# EAGLE design skillshare (EAGLE 9.6.2)
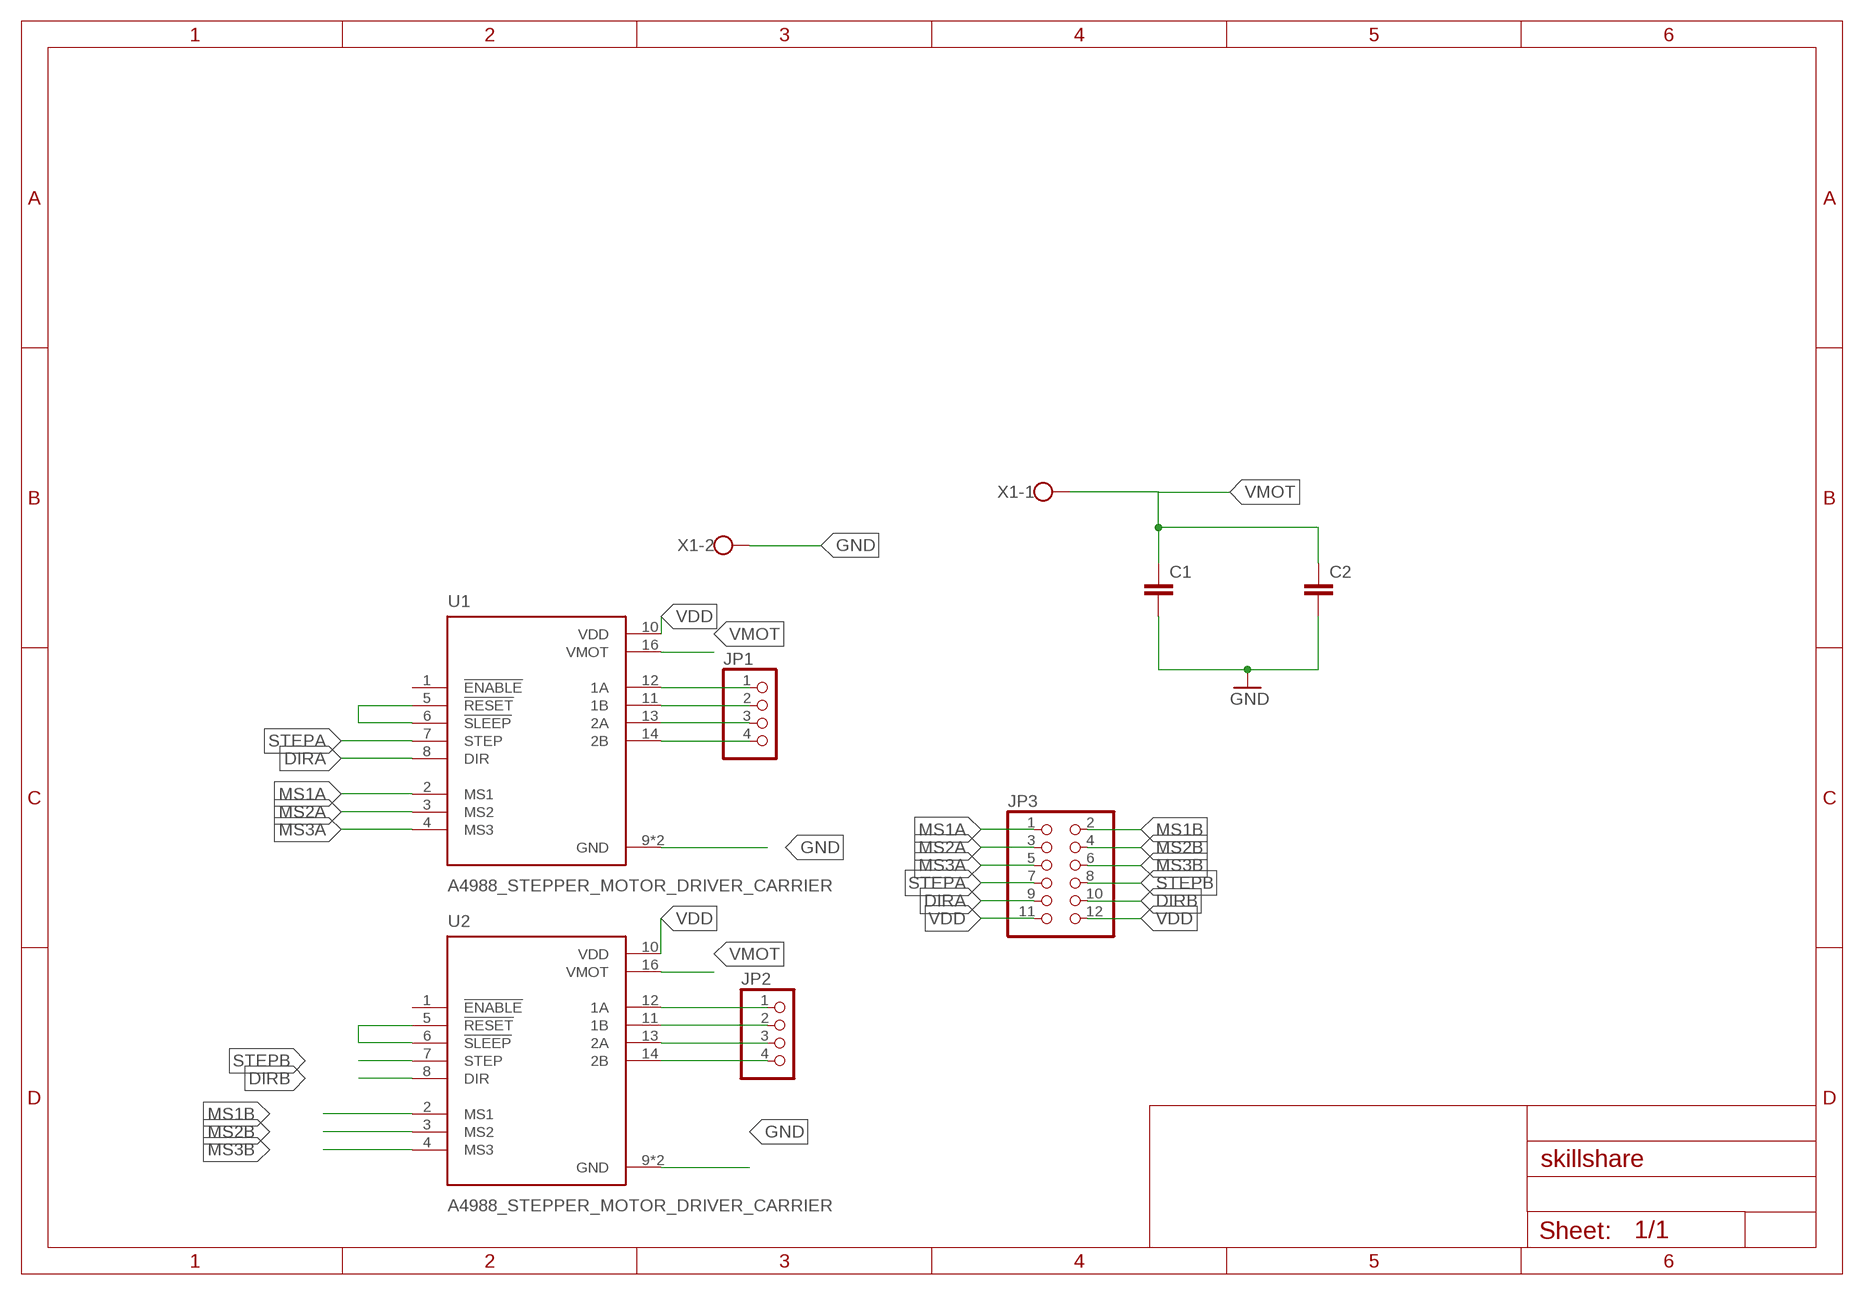
[diagram p0: schematic, sheet 1]

## Parts
C1  C-EU025-025X050  [C025-025X050]
C2  C-EU025-025X050  [C025-025X050]
JP1  PINHD-1X4  [1X04]
JP2  PINHD-1X4  [1X04]
JP3  PINHD-2X6  [2X06]
U1  A4988_STEPPER_MOTOR_DRIVER_CARRIER  [MODULE_A4988_STEPPER_MOTOR_DRIVER_CARRIER]
U2  A4988_STEPPER_MOTOR_DRIVER_CARRIER  [MODULE_A4988_STEPPER_MOTOR_DRIVER_CARRIER]
X1  W237-102  [W237-102]

## Nets
DIRA: JP3.9 U1.8(DIR)
DIRB: JP3.10 U2.8(DIR)
GND: C1.2 C2.2 U1.9(GND) U1.15(GND) U2.9(GND) U2.15(GND) X1.2
MS1A: JP3.1 U1.2(MS1)
MS1B: JP3.2 U2.2(MS1)
MS2A: JP3.3 U1.3(MS2)
MS2B: JP3.4 U2.3(MS2)
MS3A: JP3.5 U1.4(MS3)
MS3B: JP3.6 U2.4(MS3)
N$1: JP1.1 U1.12(1A)
N$2: JP1.2 U1.11(1B)
N$3: JP1.3 U1.13(2A)
N$4: JP1.4 U1.14(2B)
N$5: JP2.1 U2.12(1A)
N$6: JP2.2 U2.11(1B)
N$7: JP2.3 U2.13(2A)
N$8: JP2.4 U2.14(2B)
N$12: U2.5(!RESET) U2.6(!SLEEP)
N$15: U1.5(!RESET) U1.6(!SLEEP)
STEPA: JP3.7 U1.7(STEP)
STEPB: JP3.8 U2.7(STEP)
VDD: JP3.11 JP3.12 U1.10(VDD) U2.10(VDD)
VMOT: C1.1 C2.1 U1.16(VMOT) U2.16(VMOT) X1.1
Unconnected: U1.1(!ENABLE) U2.1(!ENABLE)

## Library data of the parts
C1 C2 = rcl:C-EU: CAPACITOR, European symbol; SPICEPREFIX: C
JP1 JP2 = pinhead:PINHD-1X4: PIN HEADER
JP3 = pinhead:PINHD-2X6: PIN HEADER
U1 U2 = A4988_STEPPER_MOTOR_DRIVER_CARRIER:A4988_STEPPER_MOTOR_DRIVER_CARRIER: Stepper motor controler; IC: A4988; 1A; Uin mot: 8÷35V Check availability <https://pricing.snapeda.com/parts/A4988%20STEPPER%20MOTOR%20DRIVER%20CARRIER/Pololu/view-part?ref=eda>; AVAILABILITY: Not in stock; DESCRIPTION: Stepper Motor Driver; MF: Pololu; MP: A4988 STEPPER MOTOR DRIVER CARRIER; PACKAGE: None; PRICE: None
X1 = con-wago-500:W237-102: WAGO SCREW CLAMP; MPN: 237-102; OC_FARNELL: unknown; OC_NEWARK: 70K9898

## Board
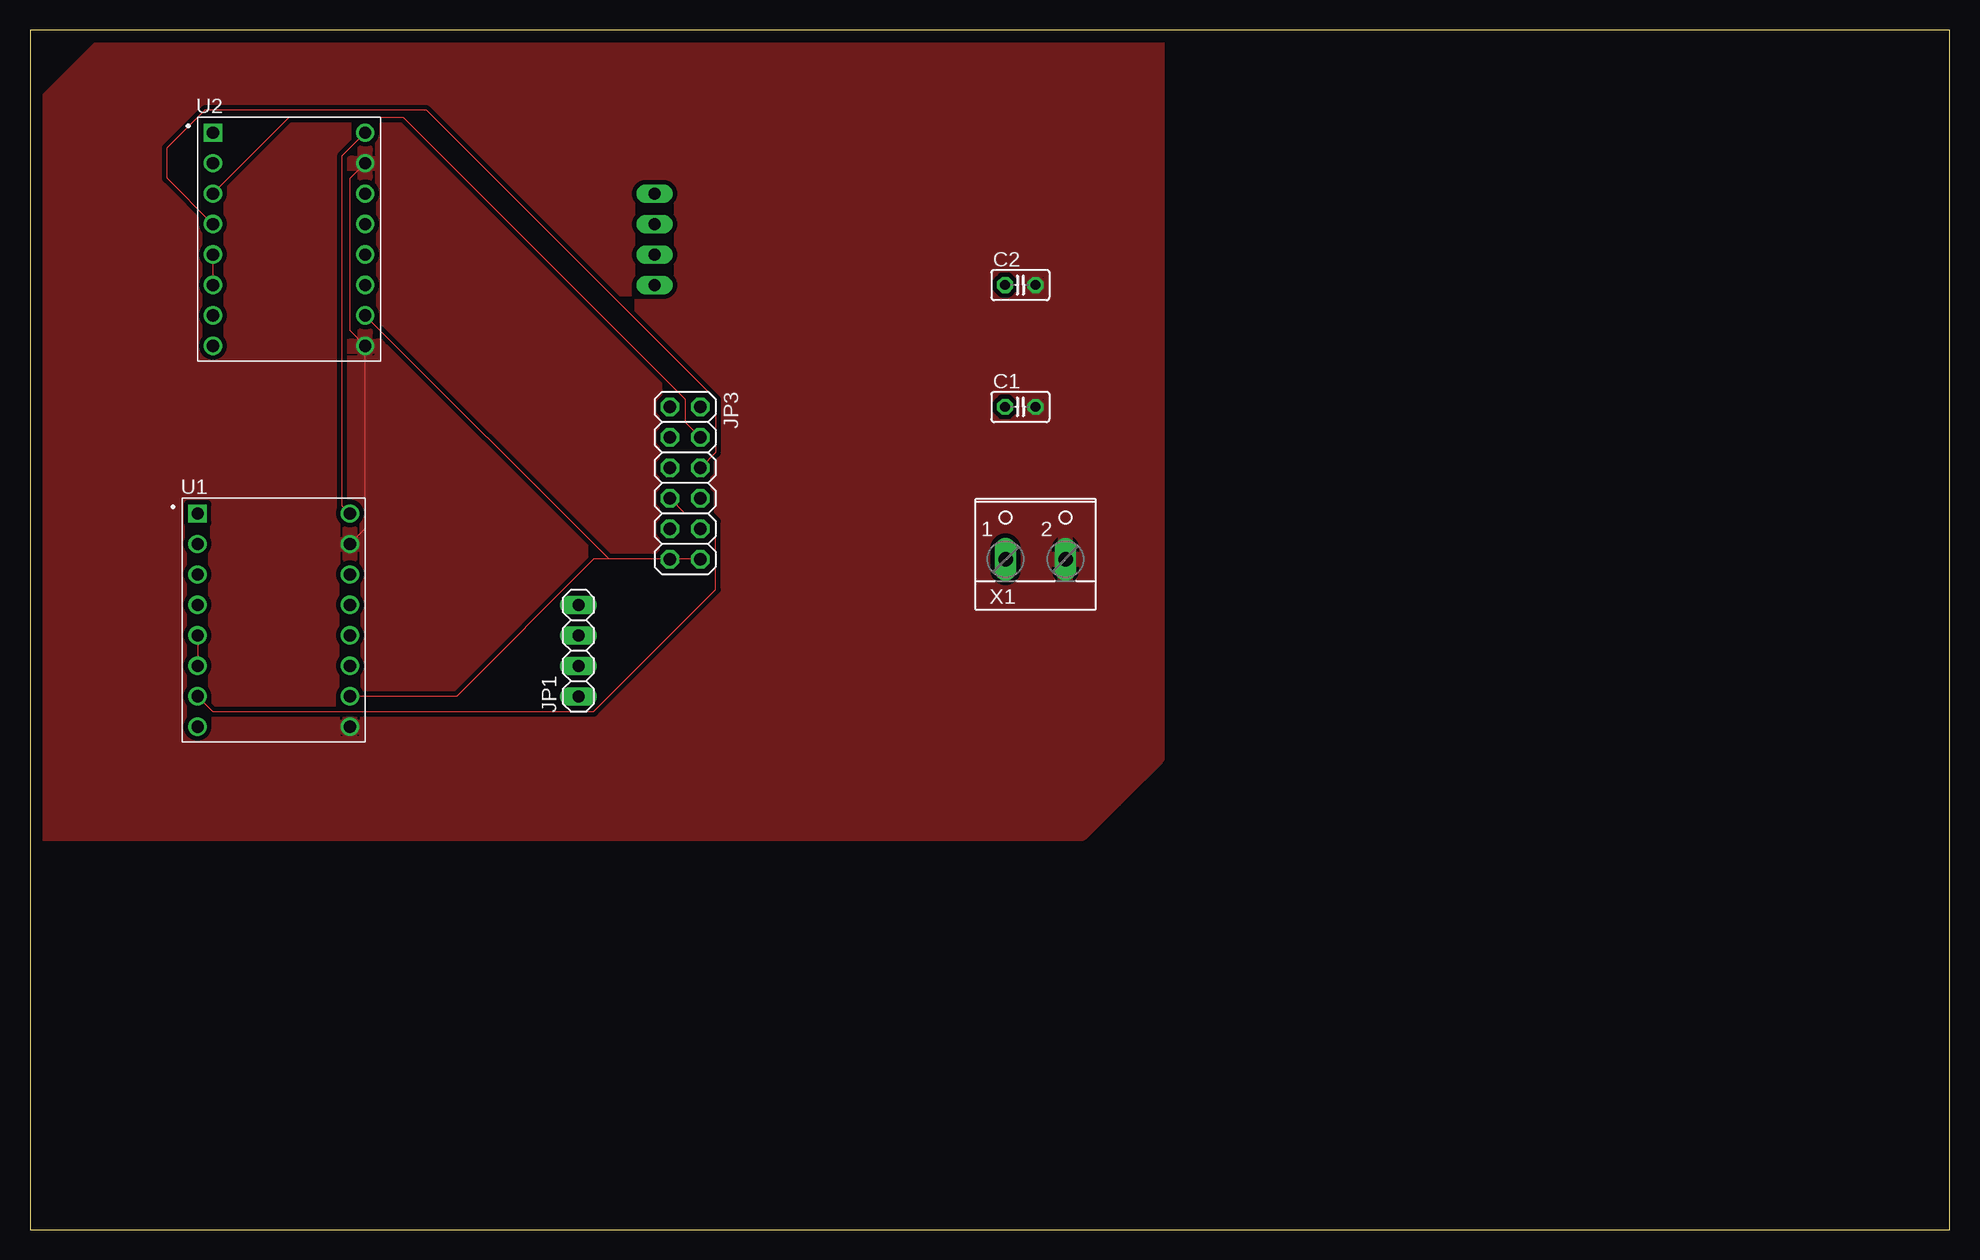
[diagram p1: board, top side]
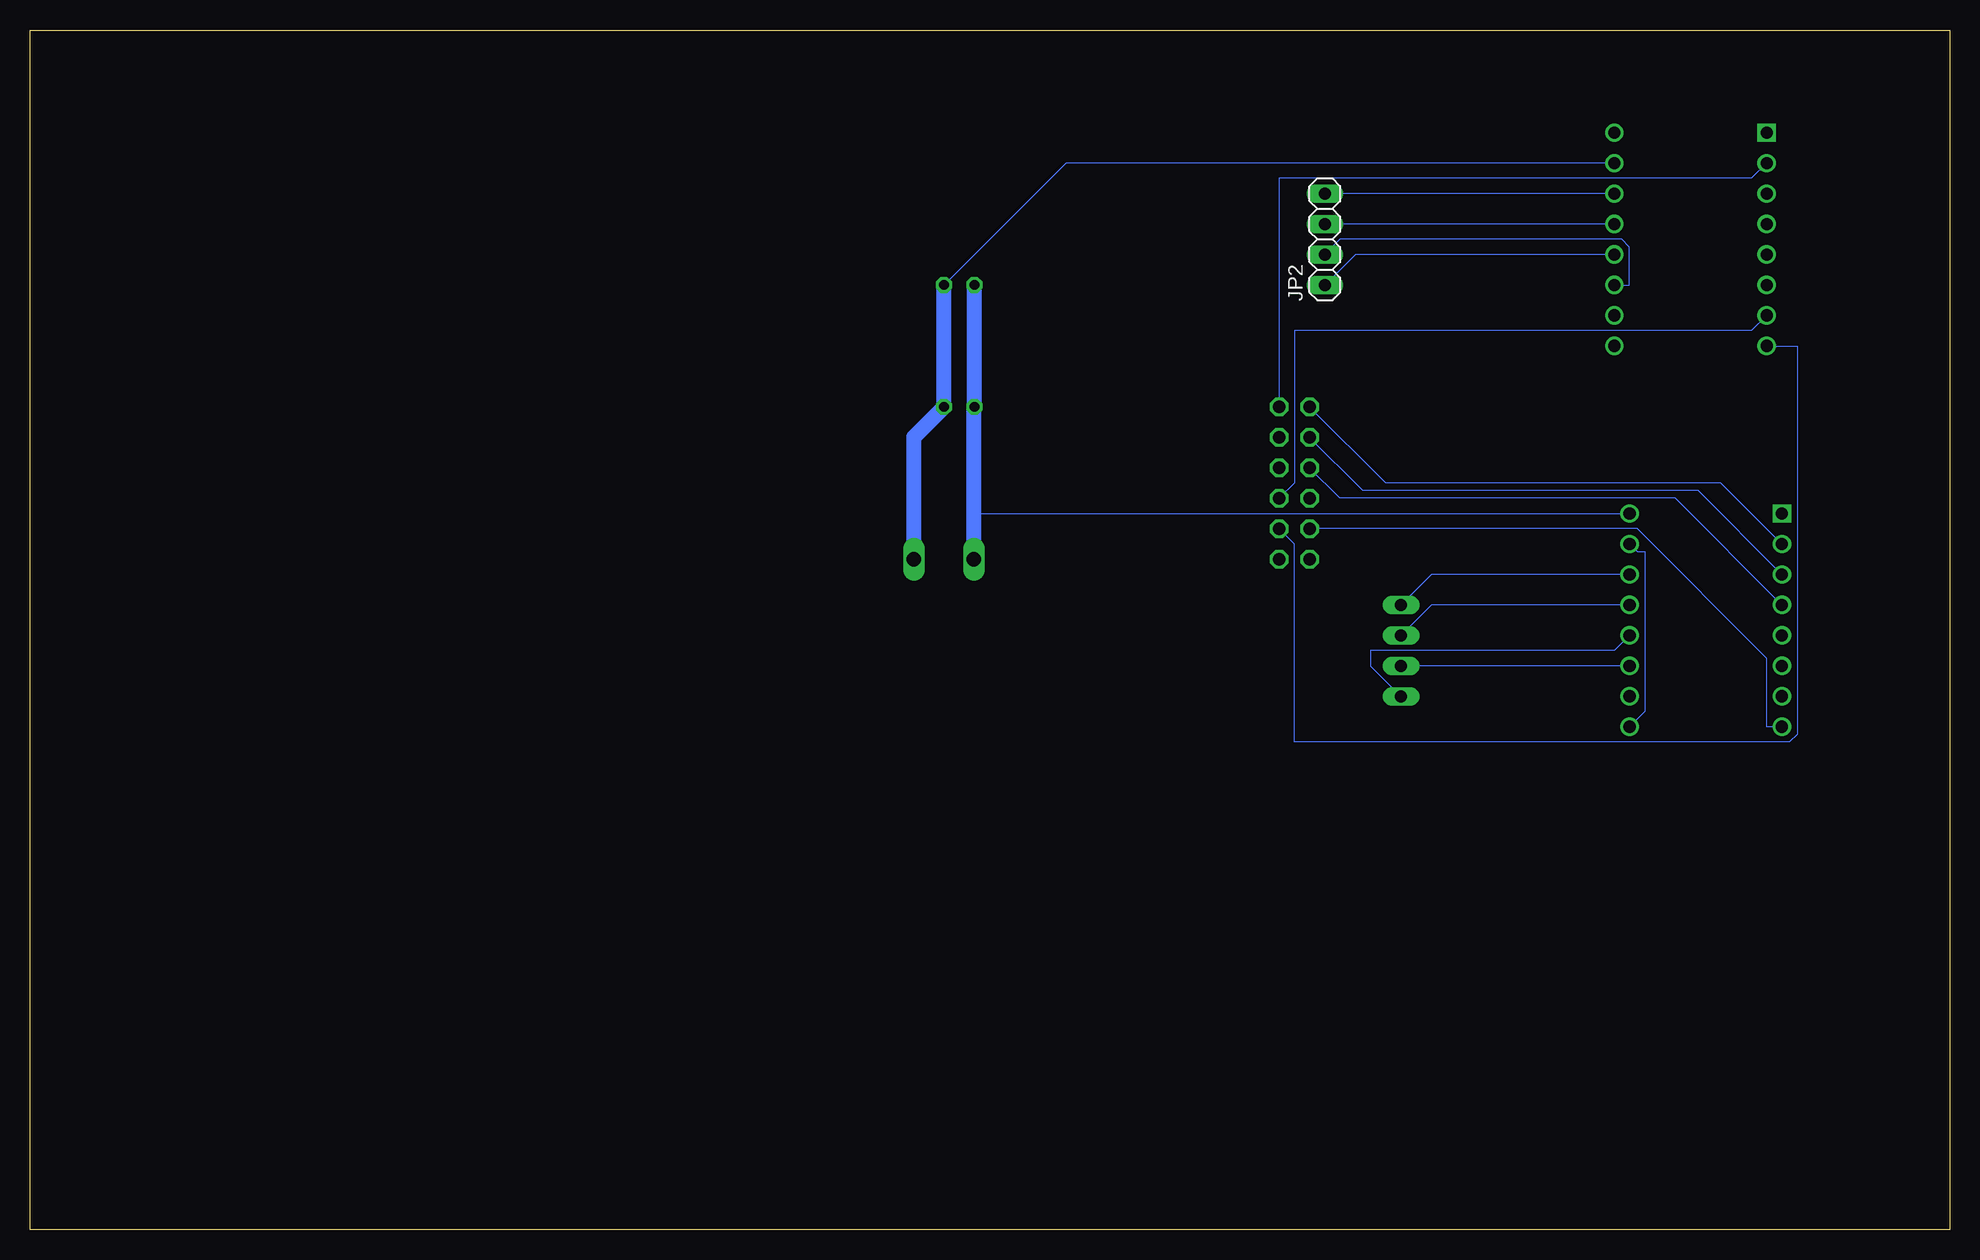
[diagram p2: board, bottom side, seen from below]

Size 160 x 100 mm. Coordinates in mm from the lower left corner, seen from the top.
Outline: 0,0 160,0 160,100 0,100 0,0
Copper layers (1*16): Top 0.035mm / dielectric 1.5mm / Bottom 0.035mm
Design rules "default *": minimum track width 3mil, minimum drill 0.35mm, track to track 15mil, track to pad 15mil, pad to pad 6mil, via to via 6mil, smd to smd 6mil, copper to edge 40mil, drill to drill 6mil, minimum pad ring 10mil, minimum via ring 8mil, stop-mask expansion 4mil, vias tented up to drill 0mil, thermal gap 10mil

### Footprints (pad centres in the part's own frame; a part is rotated, then mirrored left to right if it is on the bottom)
C025-025X050 = drill 0.813 octagon: 1 -1.27,0; 2 1.27,0
1X04 = drill 1.016 long: 1 -3.81,0; 2 -1.27,0; 3 1.27,0; 4 3.81,0
2X06 = drill 1.016 octagon: 1 -6.35,-1.27; 2 -6.35,1.27; 3 -3.81,-1.27; 4 -3.81,1.27; 5 -1.27,-1.27; 6 -1.27,1.27; 7 1.27,-1.27; 8 1.27,1.27; 9 3.81,-1.27; 10 3.81,1.27; 11 6.35,-1.27; 12 6.35,1.27
MODULE_A4988_STEPPER_MOTOR_DRIVER_CARRIER = drill 1.02 square: 1 -6.35,8.89 | drill 1.02: 2 -6.35,6.35; 3 -6.35,3.81; 4 -6.35,1.27; 5 -6.35,-1.27; 6 -6.35,-3.81; 7 -6.35,-6.35; 8 -6.35,-8.89; 9 6.35,-8.89; 10 6.35,-6.35; 11 6.35,-3.81; 12 6.35,-1.27; 13 6.35,1.27; 14 6.35,3.81; 15 6.35,6.35; 16 6.35,8.89
W237-102 = drill 1.194 long: 1 -2.5,-1.27; 2 2.5,-1.27

### Placement (x,y rotation side)
C1  82.55,68.58 0 top
C2  82.55,78.74 0 top
JP1  45.72,48.26 90 top
JP2  52.07,82.55 90 bottom
JP3  54.61,62.23 270 top
U1  20.32,50.8 0 top
U2  21.59,82.55 0 top
X1  83.82,57.15 0 top

### Tracks (layer width: path | path; a pad name or v marks a point on that pad's centre or on a via)
DIRA
  Bottom 0.076: JP3.9 26.04,58.42 15.24,47.62 15.24,41.91 U1.8
DIRB
  Bottom 0.076: JP3.10 54.61,57.15 54.61,40.64 13.34,40.64 12.7,41.27 12.7,73.66 U2.8
GND
  Top 0.076: U1.15 27.94,58.42 U2.9 26.67,74.93 26.67,87.63 U2.15
  Bottom 0.076: U1.9 25.4,43.18 25.4,56.52 26.04,56.52 U1.15 | C2.2 73.66,88.9 U2.15
  Bottom 1.27: X1.2 86.32,66.08 C1.2 C2.2
  pour Top: 1.27,33.02 87.63,33.02 93.98,39.37 93.98,99.06 6.35,99.06 0,92.71 0,34.29
MS1A
  Bottom 0.076: JP3.1 46.99,62.23 19.05,62.23 U1.2
MS1B
  Bottom 0.076: JP3.2 55.88,87.63 16.51,87.63 U2.2
MS2A
  Bottom 0.076: JP3.3 48.9,61.59 20.95,61.59 U1.3
MS2B
  Top 0.076: JP3.4 54.61,67.31 54.61,69.22 31.11,92.71 21.59,92.71 U2.3
MS3A
  Bottom 0.076: JP3.5 50.8,60.96 22.86,60.96 U1.4
MS3B
  Top 0.076: JP3.6 57.15,64.77 57.15,69.22 33.02,93.34 14.61,93.34 11.43,90.17 11.43,87.63 U2.4
N$1
  Bottom 0.076: JP1.1 48.26,46.99 48.26,48.26 27.94,48.26 U1.12
N$2
  Bottom 0.076: U1.11 JP1.2
N$3
  Bottom 0.076: JP1.3 43.18,52.07 U1.13
N$4
  Bottom 0.076: JP1.4 43.18,54.61 U1.14
N$5
  Bottom 0.076: JP2.1 49.53,81.28 U2.12
N$6
  Bottom 0.076: JP2.2 50.8,82.55 27.3,82.55 26.67,81.92 26.67,78.74 U2.11
N$7
  Bottom 0.076: U2.13 JP2.3
N$8
  Bottom 0.076: U2.14 JP2.4
N$12
  Top 0.076: U2.5 U2.6
N$15
  Top 0.076: U1.5 U1.6
STEPA
  Top 0.076: JP3.7 54.61,59.69 56.52,59.69 57.15,59.05 57.15,53.34 46.99,43.18 15.24,43.18 U1.7
STEPB
  Bottom 0.076: JP3.8 54.61,62.23 54.61,74.93 16.51,74.93 U2.7
VDD
  Top 0.076: JP3.12 JP3.11 48.26,55.88 | U1.10 35.56,44.45 46.99,55.88 48.26,55.88 | 48.26,55.88 U2.10
VMOT
  Top 0.076: U2.16 26.04,89.53 26.04,60.33 U1.16
  Bottom 0.076: 81.32,59.69 U1.16
  Bottom 1.27: X1.1 81.32,59.69 81.32,68.54 C1.1 C2.1